# EAGLE design SD_Card (EAGLE 9.2.0)
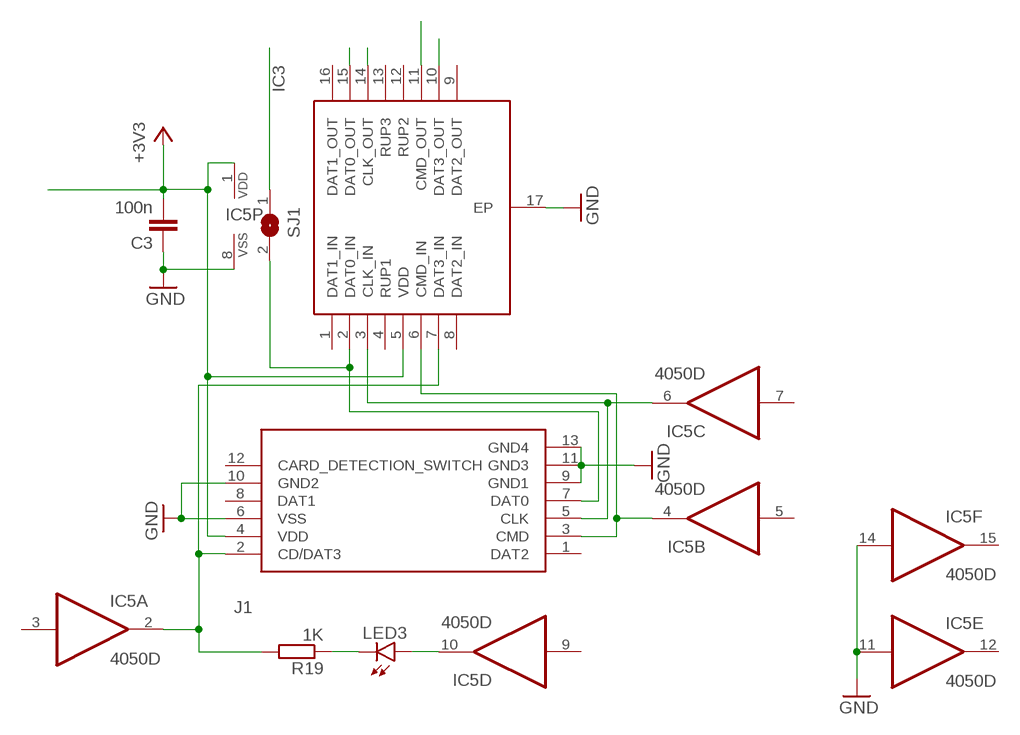
[diagram p0: schematic, sheet 1]

## Parts
C3  100n  C-EUC1206K  [C1206K]
IC3  ECLAMP2410P.TCT  [SON50P160X400X65-17N]
IC5  4050D  [SO16]
J1  DM3CS-SF  [DM3CS-SF]
LED3  LG_T679-E1F1-1  [PLCC2]
R19  1K  R-EU_R1206  [R1206]
SJ1  SJ  [SJ]

## Nets
+3V3: C3.2 IC3.5(VDD) IC5.1(P:VDD) J1.4(VDD)
GND: C3.1 IC3.17(EP) IC5.8(P:VSS) IC5.11(E:I) IC5.14(F:I) J1.6(VSS) J1.9(GND1) J1.10(GND2) J1.11(GND3) J1.13(GND4)
N$2: IC3.15(DAT0_OUT) SJ1.1
N$4: IC3.14(CLK_OUT)
N$18: IC5.10(D:O) LED3.A
N$26: LED3.C R19.1
N$29: IC3.7(DAT3_IN) IC5.2(A:O) J1.2(CD/DAT3) R19.2
N$30: IC3.2(DAT0_IN) J1.7(DAT0) SJ1.2
N$31: IC3.3(CLK_IN) IC5.6(C:O) J1.5(CLK)
N$32: IC3.6(CMD_IN) IC5.4(B:O) J1.3(CMD)
N$42: IC3.11(CMD_OUT)
N$43: IC3.10(DAT3_OUT)
Unconnected: IC3.1(DAT1_IN) IC3.4(RUP1) IC3.8(DAT2_IN) IC3.9(DAT2_OUT) IC3.12(RUP2) IC3.13(RUP3) IC3.16(DAT1_OUT) IC5.3(A:I) IC5.5(B:I) IC5.7(C:I) IC5.9(D:I) IC5.12(E:O) IC5.15(F:O) J1.1(DAT2) J1.8(DAT1) J1.12(CARD_DETECTION_SWITCH)

## Library data of the parts
C3 = rcl:C-EU: CAPACITOR, European symbol
IC3 = SamacSys_Parts:ECLAMP2410P.TCT: EClamp ESD-EMI Protect T-Flash/MicroSD Semtech ECLAMP2410P.TCT, Hex Bi-Directional EMI Filter & ESD Protector, 16-Pin SLP EP Source: Datasheet <http://www.semtech.com/images/datasheet/eclamp2410p.pdf>; ARROW_PART_NUMBER: ECLAMP2410P.TCT; ARROW_PRICE/STOCK: https://www.arrow.com/en/products/eclamp2410p.tct/semtech; DESCRIPTION: EClamp ESD-EMI Protect T-Flash/MicroSD Semtech ECLAMP2410P.TCT, Hex Bi-Directional EMI Filter & ESD Protector, 16-Pin SLP EP; HEIGHT: 0.65mm; MANUFACTURER_NAME: SEMTECH; MANUFACTURER_PART_NUMBER: ECLAMP2410P.TCT; RS_PART_NUMBER: 6910638; RS_PRICE/STOCK: http://uk.rs-online.com/web/p/products/6910638
IC5 = 40xx:4050: Hex non-inverting BUFFER
J1 = SamacSys_Parts:DM3CS-SF: MicroSD card connector, push-pull type MicroSD card connector, push-pull type Source: Datasheet <http://docs-europe.electrocomponents.com/webdocs/118f/0900766b8118f8bb.pdf>; ARROW_PART_NUMBER: DM3CS-SF; ARROW_PRICE/STOCK: https://www.arrow.com/en/products/dm3cs-sf/hirose-electric; DESCRIPTION: MicroSD card connector, push-pull type MicroSD card connector, push-pull type; HEIGHT: mm; MANUFACTURER_NAME: Hirose; MANUFACTURER_PART_NUMBER: DM3CS-SF; RS_PART_NUMBER: 1664833; RS_PRICE/STOCK: http://uk.rs-online.com/web/p/products/1664833
LED3 = led:*_T679-?-1: LC TOPLED® Low Current LED Source: http://catalog.osram-os.com .. LG_LS_LY_T679_OBS.pdf; COLOR: green
R19 = rcl:R-EU_: RESISTOR, European symbol; SPICEPREFIX: R
SJ1 = jumper:SJ: SMD solder JUMPER

## Board
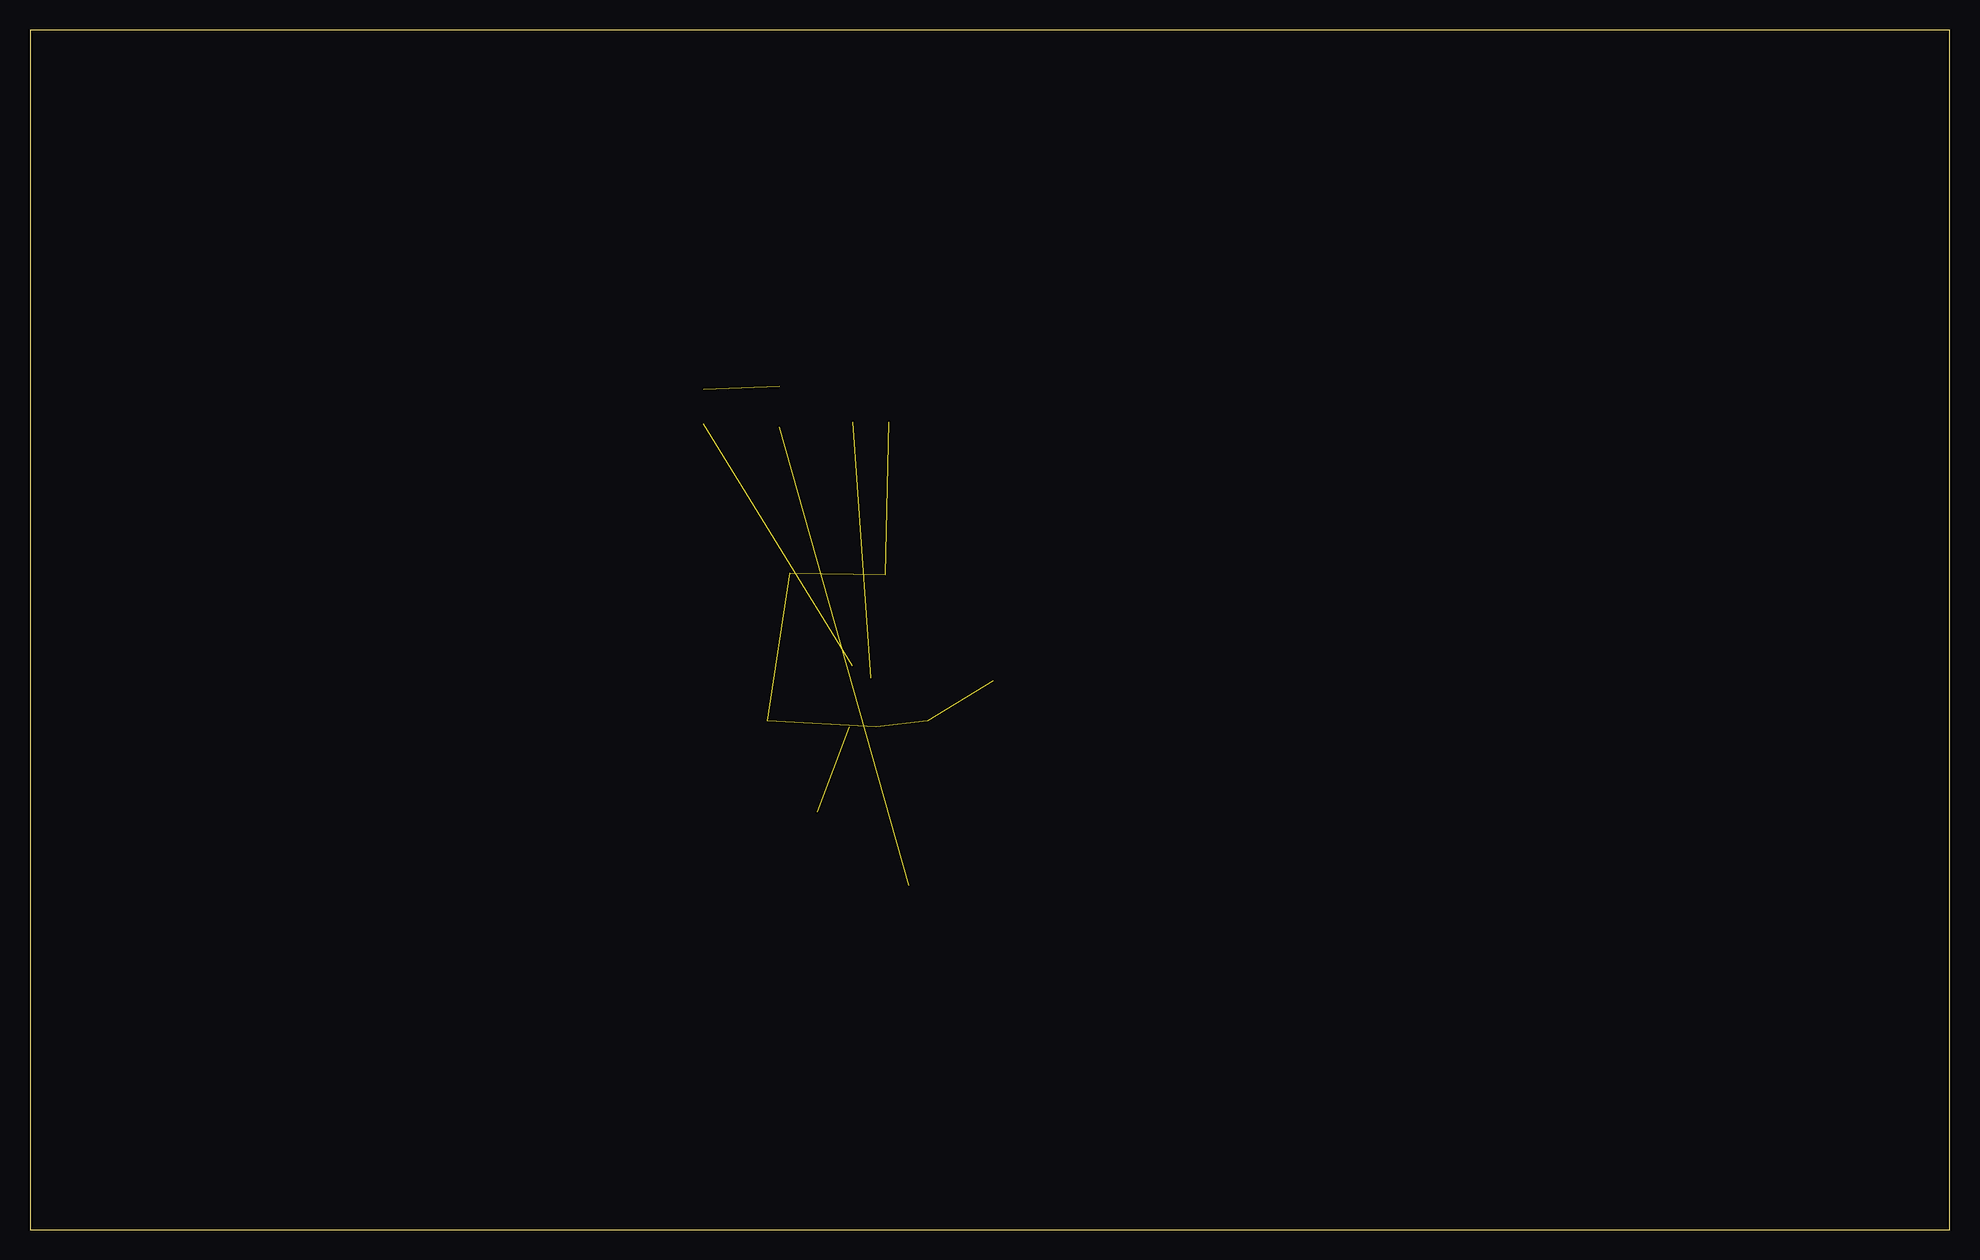
[diagram p1: board, top side]
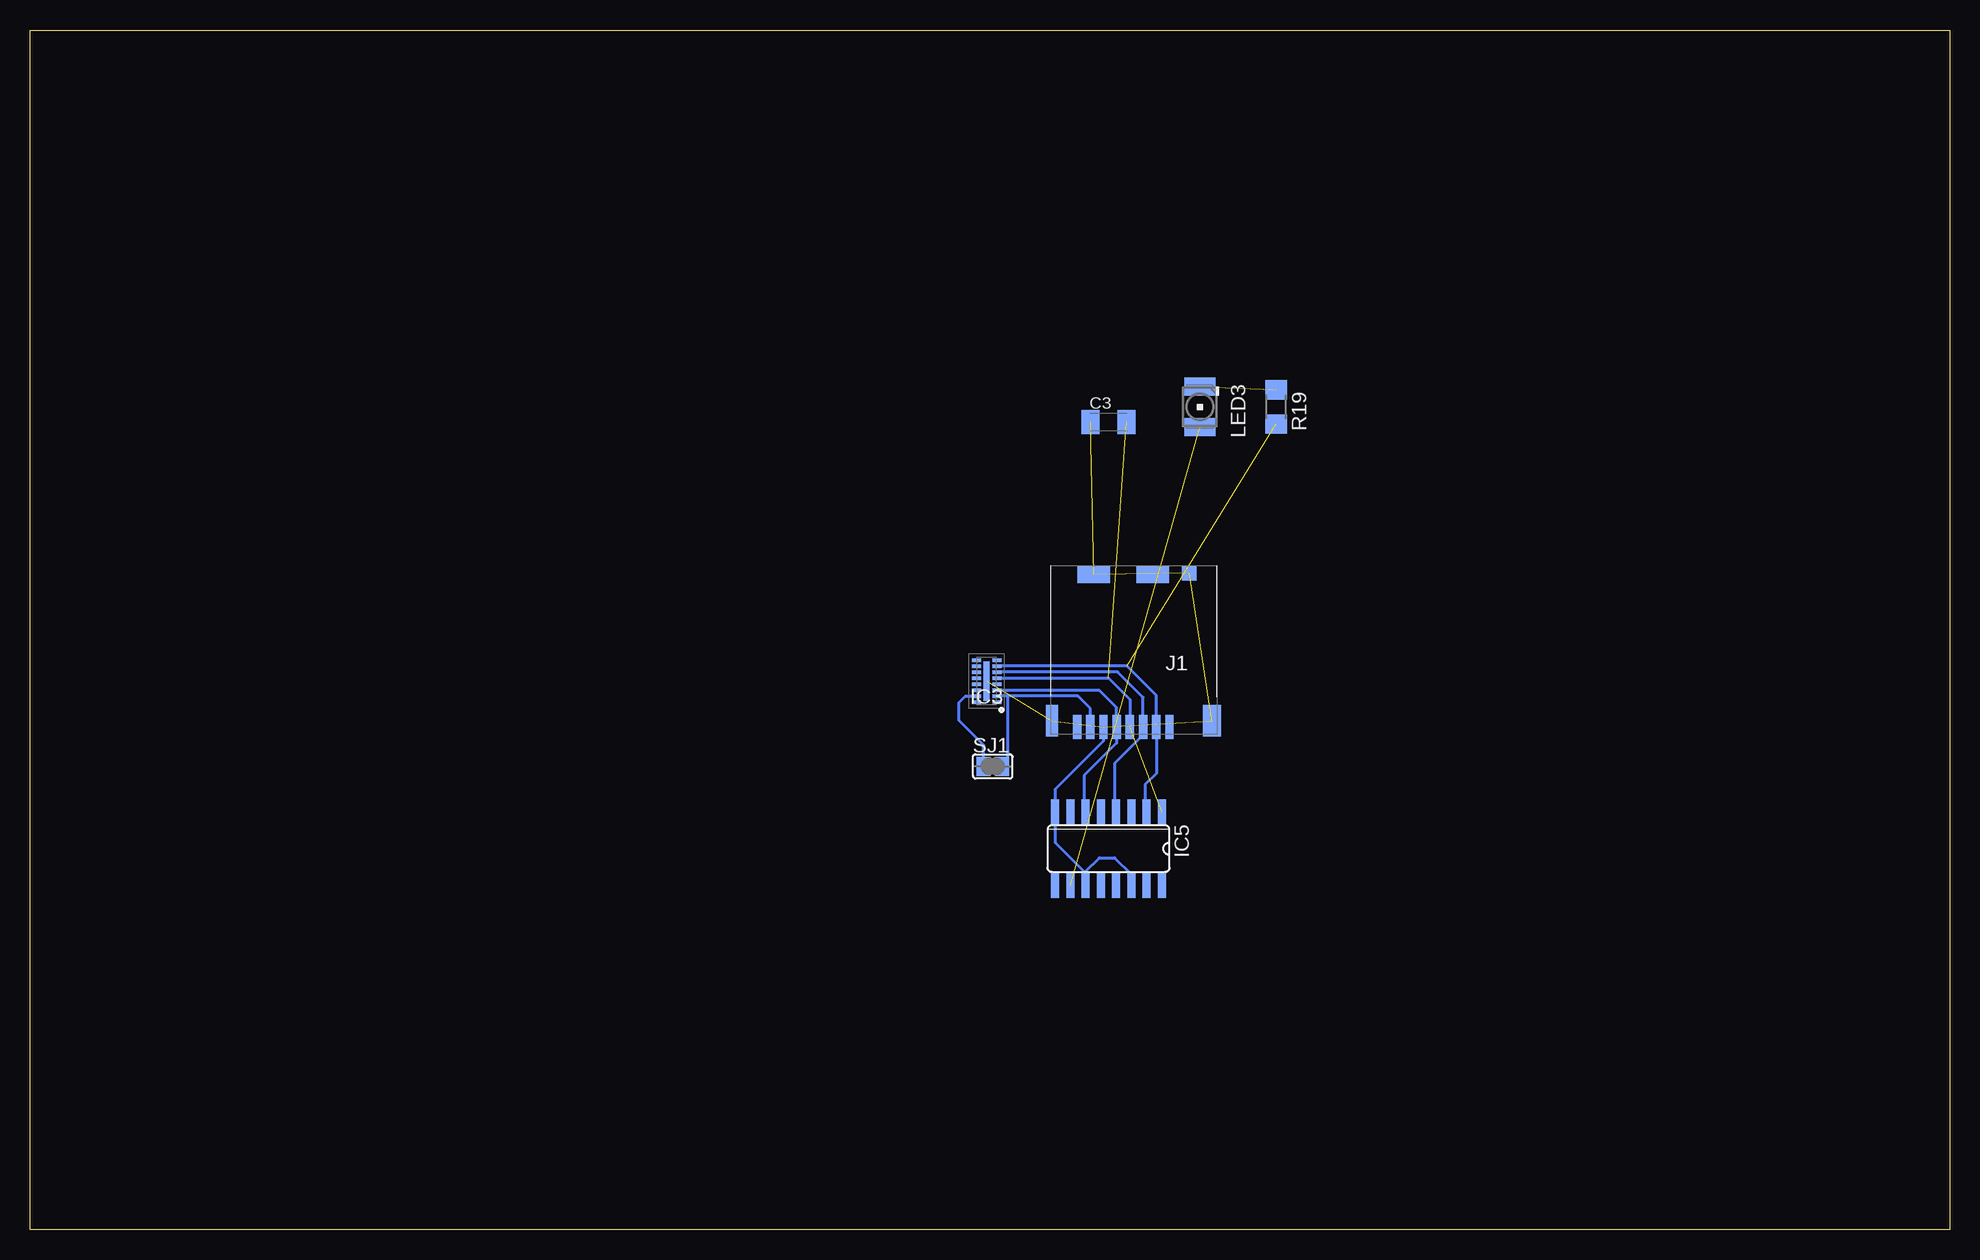
[diagram p2: board, bottom side, seen from below]

Size 160 x 100 mm. Coordinates in mm from the lower left corner, seen from the top.
Outline: 0,0 160,0 160,100 0,100 0,0
Copper layers (1*16): Top 0.035mm / dielectric 1.5mm / Bottom 0.035mm
Design rules "default": minimum track width 6mil, minimum drill 0.35mm, track to track 6mil, track to pad 6mil, pad to pad 6mil, via to via 6mil, smd to smd 6mil, copper to edge 40mil, drill to drill 6mil, minimum pad ring 10mil, minimum via ring 8mil, stop-mask expansion 4mil, vias tented up to drill 0mil, thermal gap 10mil

### Footprints (pad centres in the part's own frame; a part is rotated, then mirrored left to right if it is on the bottom)
C1206K = smd 1.5 x 2: 1 -1.5,0; 2 1.5,0
SON50P160X400X65-17N = smd 0.75 x 0.3: 1 -0.85,1.75; 2 -0.85,1.25; 3 -0.85,0.75; 4 -0.85,0.25; 5 -0.85,-0.25; 6 -0.85,-0.75; 7 -0.85,-1.25; 8 -0.85,-1.75; 9 0.85,-1.75; 10 0.85,-1.25; 11 0.85,-0.75; 12 0.85,-0.25; 13 0.85,0.25; 14 0.85,0.75; 15 0.85,1.25; 16 0.85,1.75 | smd 0.5 x 3.3: 17 0,0
SO16 = smd 0.66 x 2.032: 1 -4.445,-3.073; 2 -3.175,-3.073; 3 -1.905,-3.073; 4 -0.635,-3.073; 5 0.635,-3.073; 6 1.905,-3.073; 7 3.175,-3.073; 8 4.445,-3.073; 9 4.445,3.073; 10 3.175,3.073; 11 1.905,3.073; 12 0.635,3.073; 13 -0.635,3.073; 14 -1.905,3.073; 15 -3.175,3.073; 16 -4.445,3.073
DM3CS-SF = smd 0.7 x 2: 1 0,0; 2 -1.1,0; 3 -2.2,0; 4 -3.3,0; 5 -4.4,0; 6 -5.5,0; 7 -6.6,0; 8 -7.7,0 | smd 1 x 2.6: 9 -9.8,0.5 | smd 1.5 x 2.6: 10 3.55,0.5 | smd 1.2 x 1.2: 11 1.65,12.8 | smd 2.7 x 1.4: 12 -1.4,12.7; 13 -6.3,12.7
PLCC2 = smd 2.6 x 1.5: A 0,1.7; C 0,-1.7
R1206 = smd 1.6 x 1.803: 1 -1.422,0; 2 1.422,0
SJ = smd 1.168 x 1.6: 1 -0.762,0; 2 0.762,0

### Placement (x,y rotation side)
C3  70.1,67.31 0 bottom
IC3  80.26,45.72 180 bottom
IC5  70.1,31.75 180 bottom
J1  65.02,41.91 0 bottom
LED3  62.48,68.58 180 bottom
R19  56.13,68.58 270 bottom
SJ1  79.76,38.61 0 bottom

### Tracks (layer width: path | path; a pad name or v marks a point on that pad's centre or on a via)
+3V3  (2 unrouted)
  Bottom 0.254: IC3.5 70.1,45.97 68.32,44.19 J1.4
GND  (6 unrouted)
  Bottom 0.254: J1.6 70.52,40.73 74.55,36.7 IC5.8 74.55,32.26 72.01,29.72 | IC5.11 72.01,29.72 | 72.01,29.72 72.01,29.84 70.87,30.99 69.6,30.99 68.2,29.59 IC5.14
N$2
  Bottom 0.254: SJ1.1 80.52,40.39 82.55,42.42 82.55,43.94 82.02,44.47 IC3.15
N$18  (1 unrouted)
N$26  (1 unrouted)
N$29  (1 unrouted)
  Bottom 0.254: IC5.2 67.06,34.95 67.06,37.08 66.12,38.02 J1.2 66.12,44.53 68.58,46.99 79.39,46.99 IC3.7
N$30
  Bottom 0.254: J1.7 71.62,43.43 72.66,44.47 78.49,44.47 | 78.49,44.47 IC3.2 | SJ1.2 78.49,39.12 78.49,44.47
N$31
  Bottom 0.254: IC5.6 72.14,34.95 72.14,37.85 69.42,40.56 J1.5 69.42,43.52 70.87,44.96 79.4,44.96 IC3.3
N$32
  Bottom 0.254: IC5.4 69.6,34.95 69.6,38.86 67.22,41.23 J1.3 67.22,44.36 69.34,46.48 79.4,46.48 IC3.6